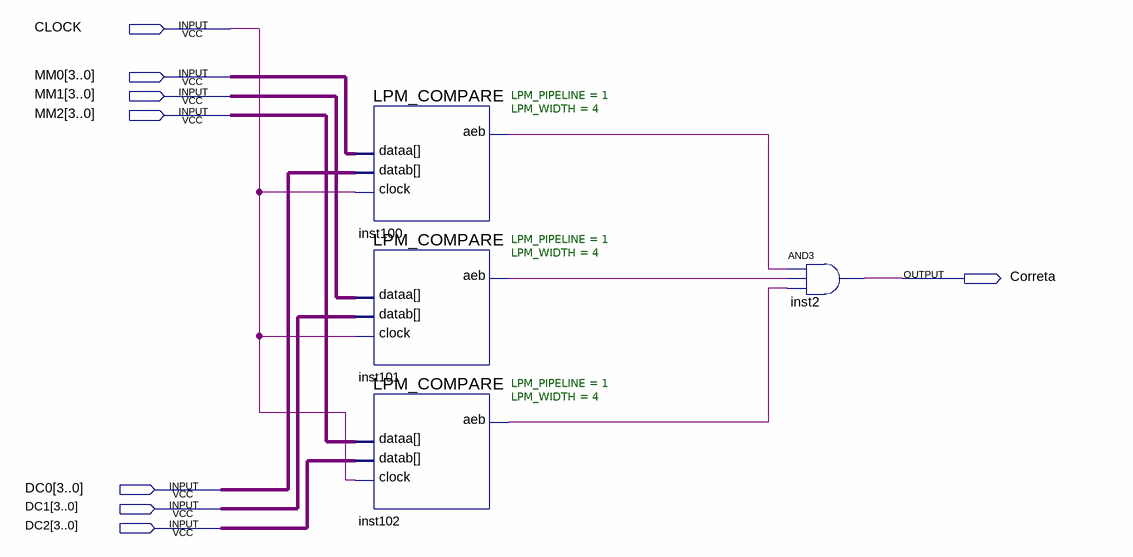
[diagram p0: schematic sheet]
// Quartus schematic Comparador.bdf as structural Verilog: 4 symbols, 8 pins
module Comparador (
  input  CLOCK,
  input  [3:0] MM0,
  input  [3:0] MM1,
  input  [3:0] MM2,
  input  [3:0] DC0,
  input  [3:0] DC1,
  input  [3:0] DC2,
  output Correta
);

  wire inst100_aeb, inst101_aeb, inst102_aeb;

  LPM_COMPARE #(.LPM_PIPELINE(1), .LPM_WIDTH(4)) inst100 (.clock(CLOCK), .dataa(MM0), .datab(DC0), .aeb(inst100_aeb));
  LPM_COMPARE #(.LPM_PIPELINE(1), .LPM_WIDTH(4)) inst101 (.clock(CLOCK), .dataa(MM1), .datab(DC1), .aeb(inst101_aeb));
  LPM_COMPARE #(.LPM_PIPELINE(1), .LPM_WIDTH(4)) inst102 (.clock(CLOCK), .dataa(MM2), .datab(DC2), .aeb(inst102_aeb));
  and inst2 (Correta, inst100_aeb, inst101_aeb, inst102_aeb);
endmodule
